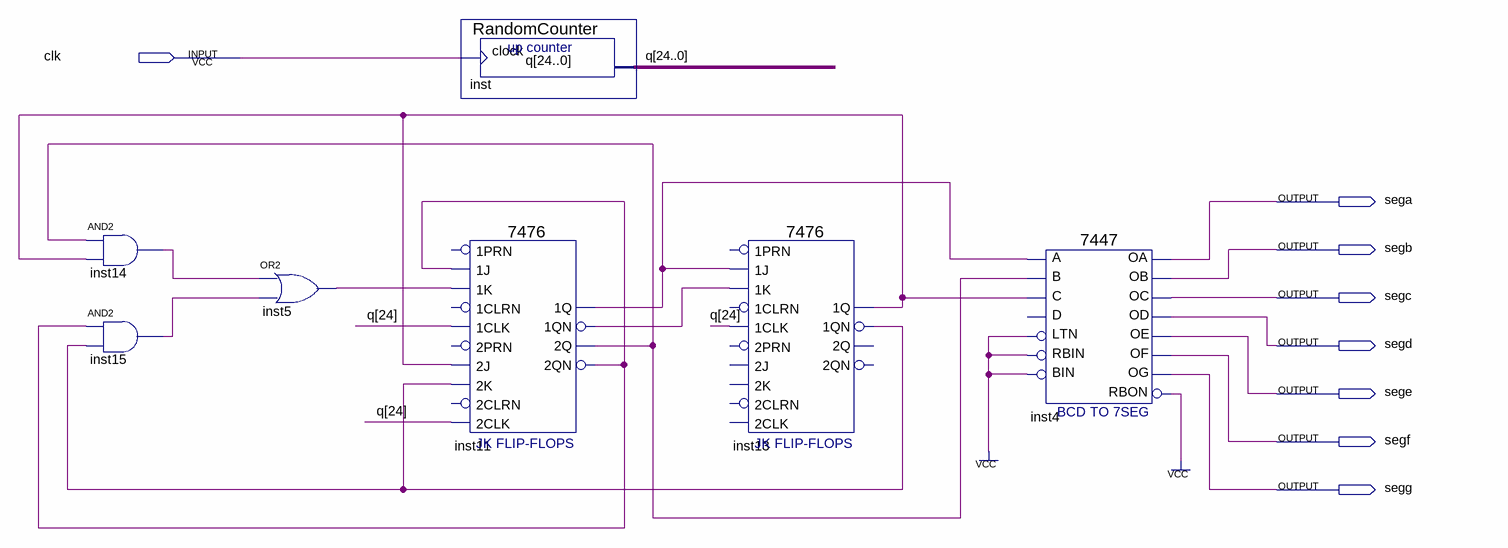
[diagram p0: schematic sheet]
// Quartus schematic Random_Synchronous_Counter.bdf as structural Verilog: 7 symbols, 8 pins
module Random_Synchronous_Counter (
  input  clk,
  output sega,
  output segb,
  output segc,
  output segd,
  output sege,
  output segf,
  output segg
);

  wire inst4_rbon, inst5_out, inst11_1q, inst11_1qn, inst11_2q, inst11_2qn, inst13_1q, inst13_1qn,
       inst14_out, inst15_out;
  wire [24:0] q;

  and inst14 (inst14_out, inst11_2q, inst13_1q);
  and inst15 (inst15_out, inst11_2qn, inst13_1qn);
  or inst5 (inst5_out, inst14_out, inst15_out);
  RandomCounter inst (.clock(clk), .q(q));
  \7476  inst11 (
    .\1J (inst11_2qn), .\1K (inst5_out), .\2J (inst13_1q), .\1CLK (q[24]), .\2K (inst13_1qn), .\2CLK (q[24]),
    .\2QN (inst11_2qn), .\1Q (inst11_1q), .\2Q (inst11_2q), .\1QN (inst11_1qn));  // open: 1PRN, 2PRN, 1CLRN, 2CLRN
  \7476  inst13 (
    .\1J (inst11_1q), .\1K (inst11_1qn), .\1CLK (q[24]), .\1Q (inst13_1q), .\1QN (inst13_1qn));  // open: 1PRN, 2PRN, 2J, 1CLRN, 2K, 2CLRN, 2CLK, 2QN, 2Q
  \7447  inst4 (
    .LTN(1'b1), .B(inst11_2q), .C(inst13_1q), .RBIN(1'b1), .BIN(1'b1), .A(inst11_1q), .OB(segb), .OC(segc),
    .OE(sege), .OD(segd), .OF(segf), .OG(segg), .OA(sega), .RBON(inst4_rbon));  // open: D
  // also tied to VCC on the sheet: inst4_rbon
endmodule
